# Altium schematic sheet MACH_LUC.SchDoc
size A
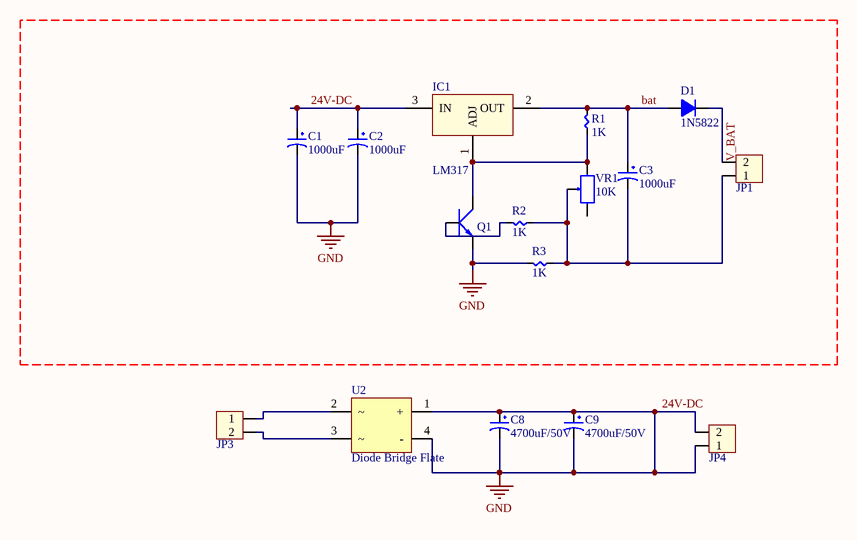
[diagram p0: MACH_LUC.SchDoc]

## Parts
C1  1000uF  [CP2/4]
C2  1000uF  [CP2/4]
C3  1000uF  [CP2/4]
C8  4700uF/50V  [CP4/8.5]
C9  4700uF/50V  [CP4/8.5]
D1  1N5822  [D5A]
IC1  LM317  [QTO-220]
JP1  Connector 2  [CON2]  (value not drawn)
JP3  Connector 2  [CON2]  (value not drawn)
JP4  Connector 2  [CON2]  (value not drawn)
Q1  C9014  [QTO-92]  (value not drawn)
R1  1K  [SM-0805]
R2  1K  [SM-0805]
R3  1K  [SM-0805]
U2  Diode Bridge Flate  [DIODE BRIDGE(FLAT)]
VR1  10K  [VR]

## Nets
24V-DC: C1.1 C1.2 C2.1 C2.2 C8.1 C8.2 C9.1 C9.2 IC1.3(IN) JP4.1 JP4.2 Q1.1(E) R3.1 U2.1(+) U2.4(-)  [also labelled GND]
bat: C3.1 D1.1(A) IC1.2(OUT) R1.1
V_BAT: D1.2(K) JP1.2
NetC3_2: C3.2 JP1.1 R2.2 R3.2 VR1.2
NetIC1_1: IC1.1(ADJ) Q1.3(C) R1.2 VR1.3
NetJP3_1: JP3.1 U2.2
NetJP3_2: JP3.2 U2.3
NetQ1_2: Q1.2(B) R2.1

Not connected (* = marked no-connect by the designer): VR1 1

## Library data of the parts
C1-C3 = CP2: C 47uF/50V , 220uF/16V; Value: 47uF/16 - 50V; Description 1: 470uF/6,3V - 330uF/10V - 220uF/16V; Description 2: 100uF/25V - 35V - 47uF/50V - 22uF/100V; Description 3: 33uF => 47uF/63V - 1uF => 4,7uF/160V; Description 4: 1uF => 2,2uF/250V - 1uF/350V
C8 C9 = CP7: Cap 4700uF/50V; Value: 4700uF/50V
D1 = D5A: Diode 5A; Value: 1N5408
IC1 = LM317: Adj Voltage +1.2 -> +37V; Value: LM317
JP1 JP3 JP4 = CON2: Value: Connector 2
Q1 = NPN_EBC: P 600mW, EBC; Value: C9014
R1-R3 = RES 0805 BUT: Resistor
U2 = Diode Bridge Flate: Diode Bridge
VR1 = Vr: Var Resistor; Value: VR 10K